# EAGLE board Spring2020 (EAGLE 9.5.1), part 1 of 2
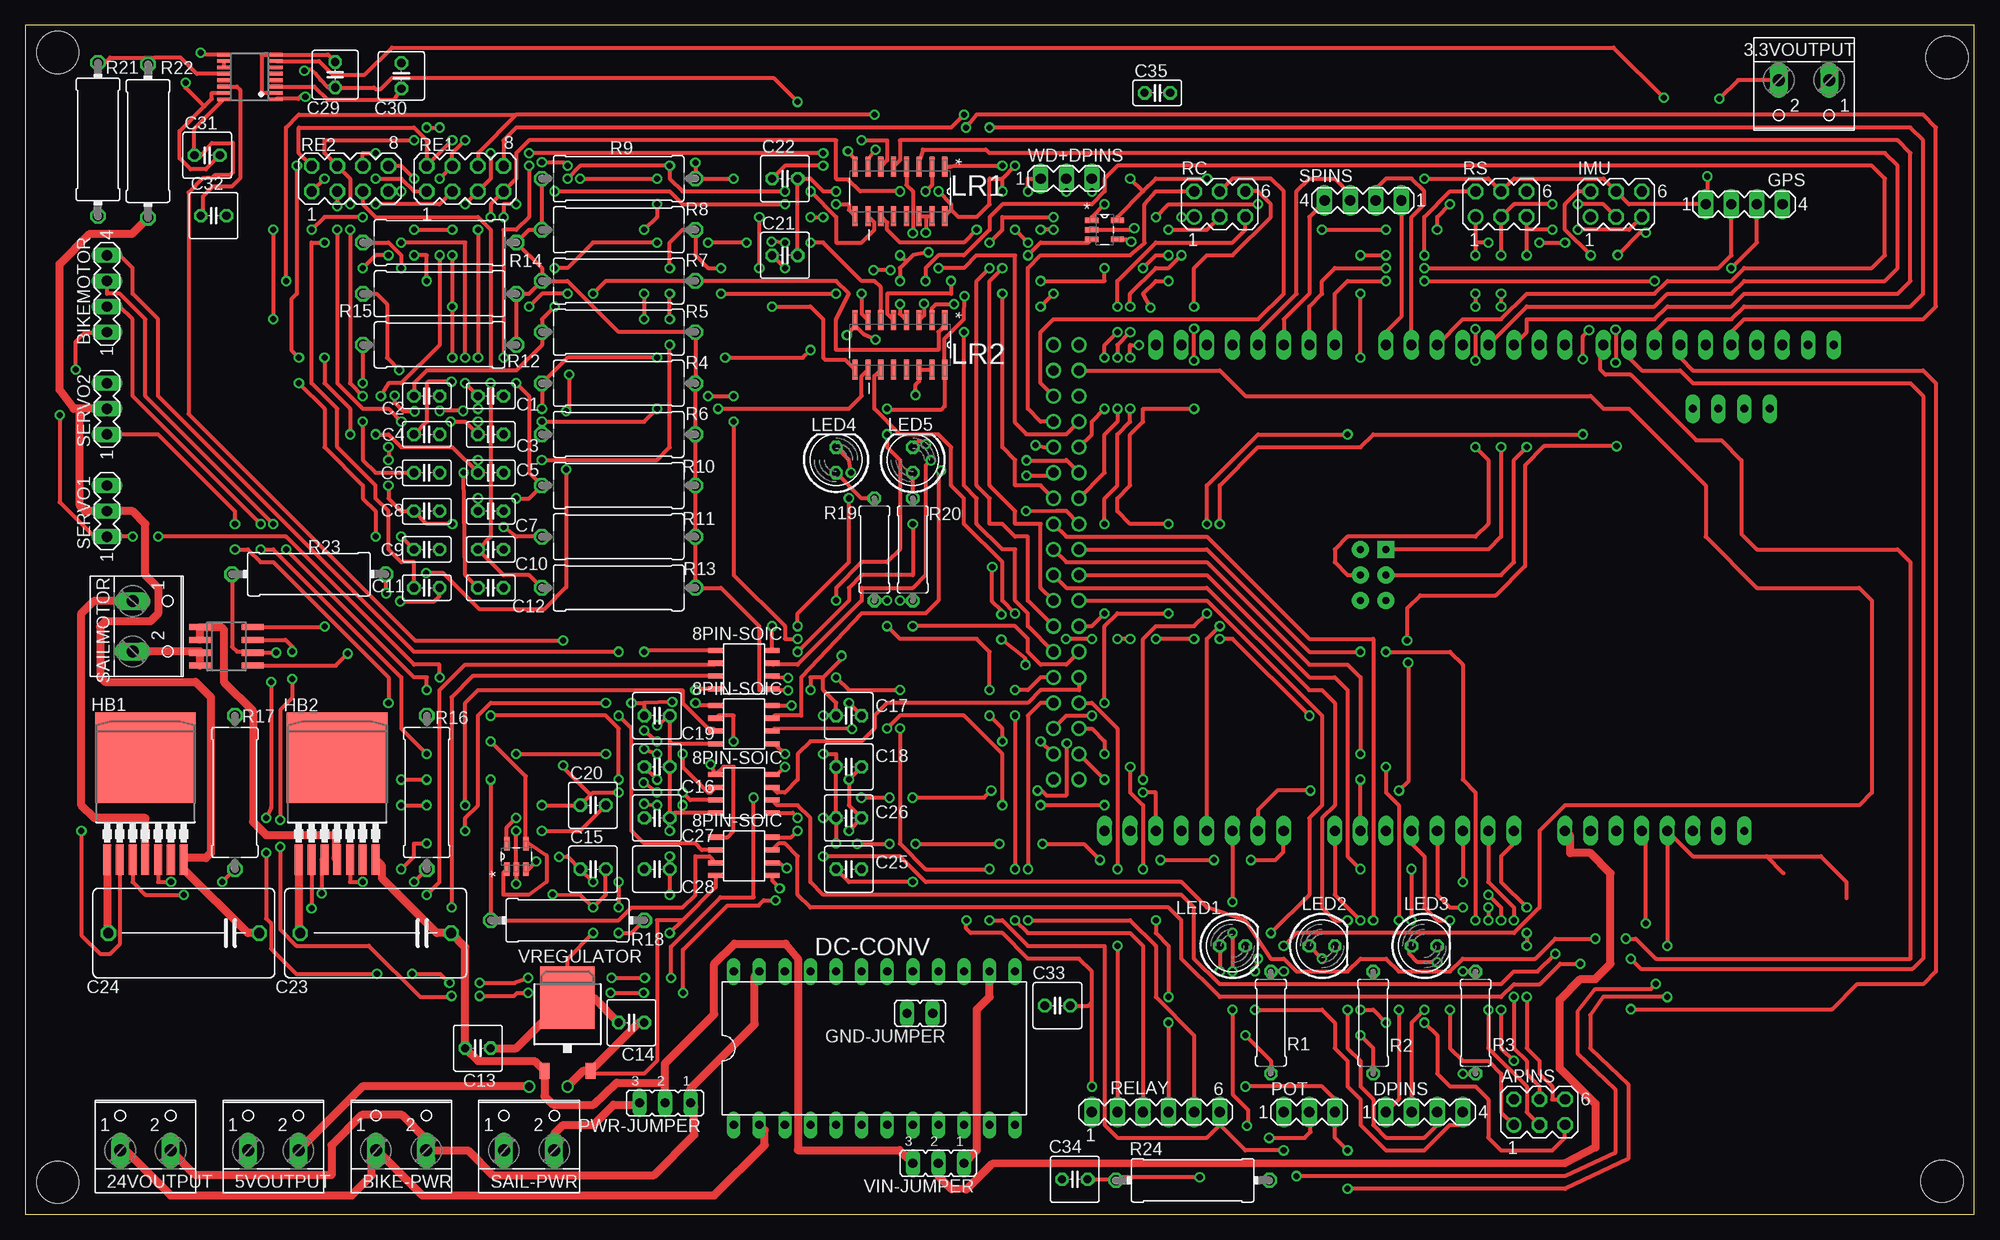
[diagram p2: board, top side]
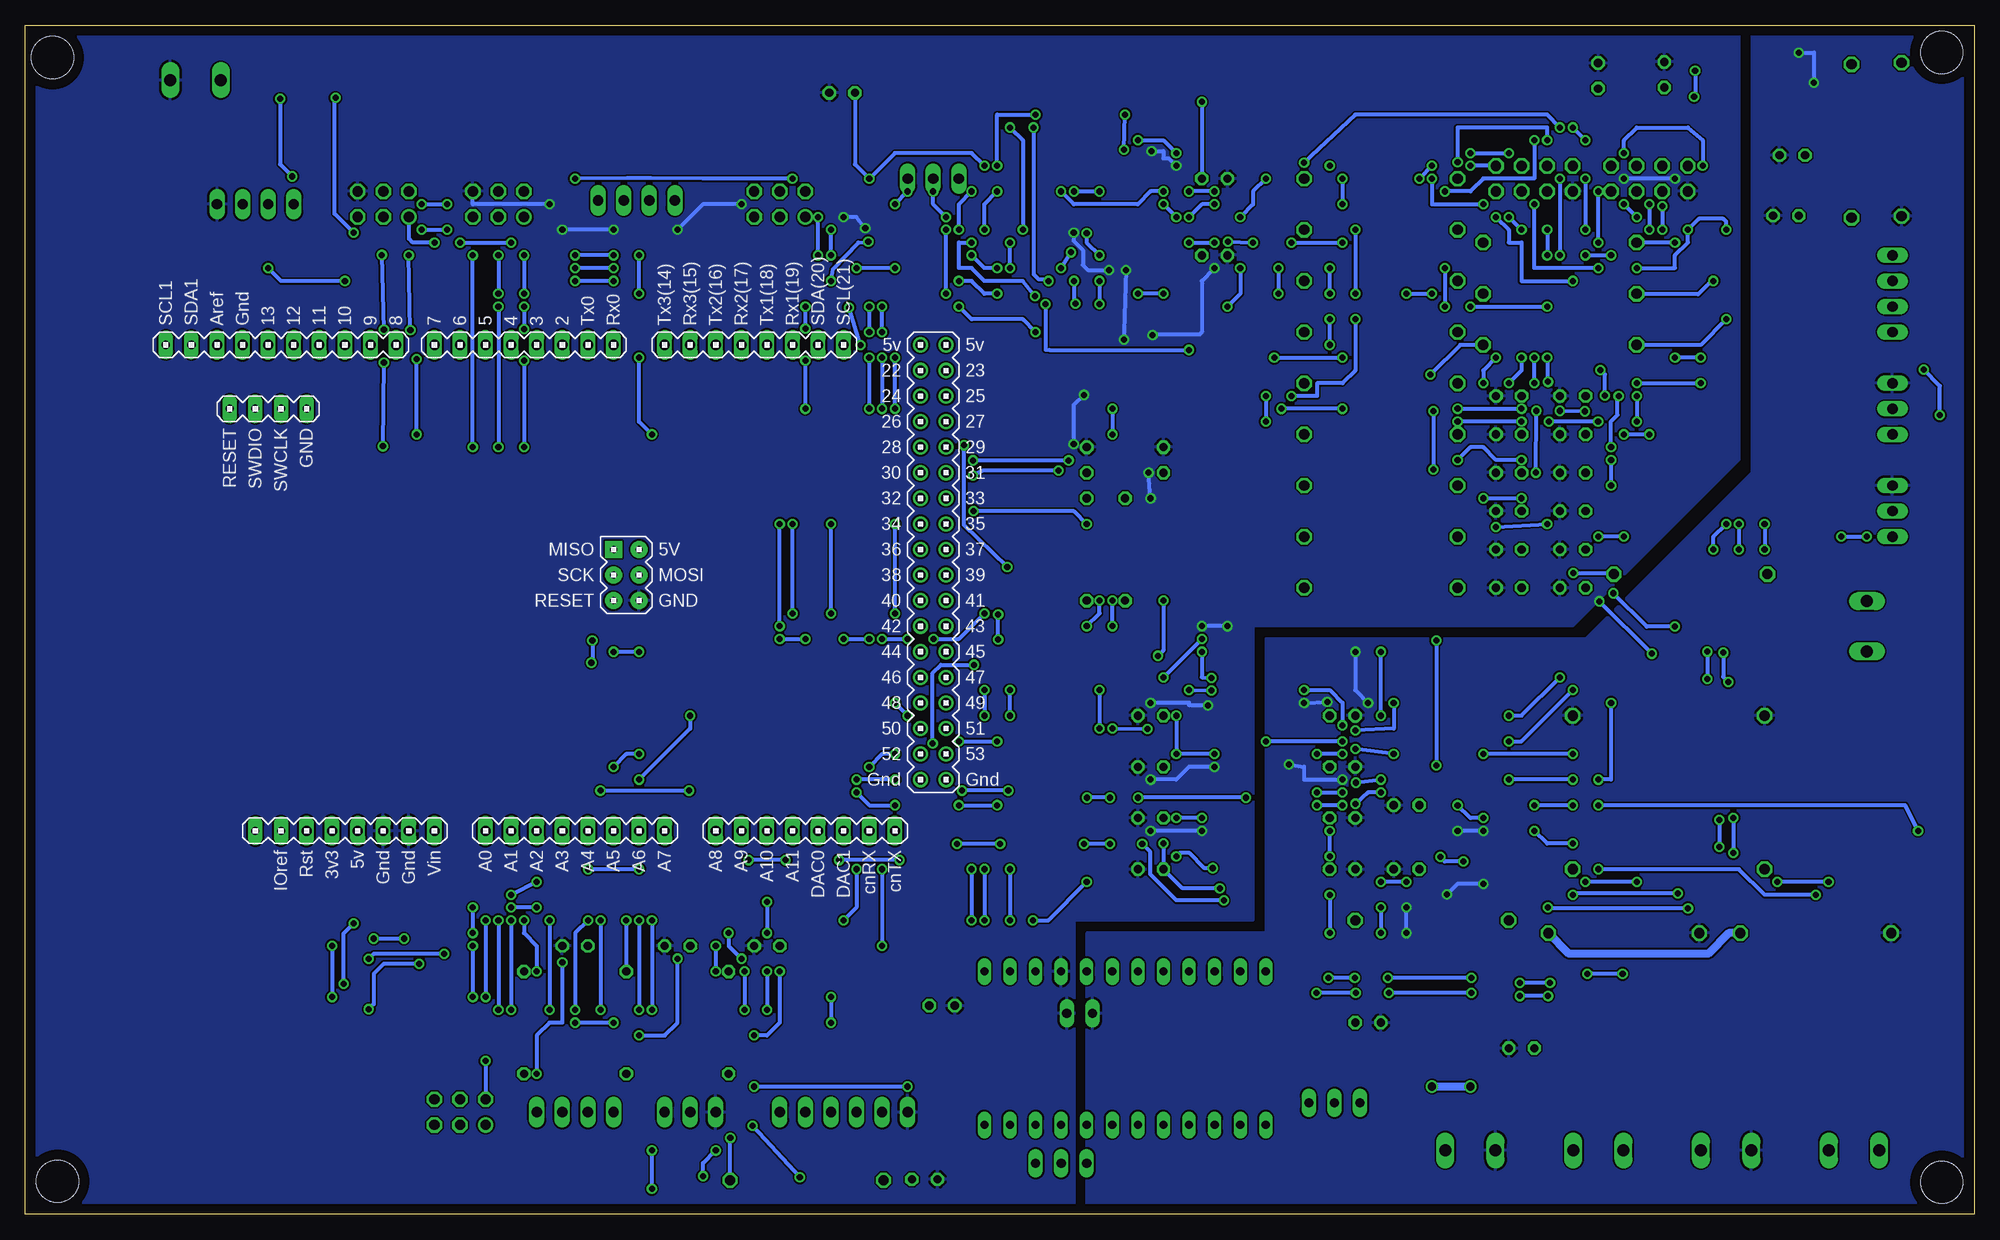
[diagram p3: board, bottom side, seen from below]

Size 193.55 x 118.11 mm. Coordinates in mm from the lower left corner, seen from the top.
Outline: 0,0 193.55,0 193.55,118.11 0,118.11 0,0
Copper layers (1*16): Top 0.035mm / dielectric 1.5mm / Bottom 0.035mm
Design rules "default *": minimum track width 10mil, minimum drill 0.6mm, track to track 7mil, track to pad 7mil, pad to pad 7mil, via to via 7mil, smd to smd 7mil, copper to edge 40mil, drill to drill 7mil, minimum pad ring 10mil, minimum via ring 8mil, stop-mask expansion 4mil, vias tented up to drill 0mil, thermal gap 10mil
Holes 4.2 mm at 3.23,3.19 3.23,115.39 190.83,114.89 190.33,3.29

## Footprints (pad centres in the part's own frame; a part is rotated, then mirrored left to right if it is on the bottom)
W237-102 = drill 1.194 long: 1 -2.5,-1.27; 2 2.5,-1.27
MA03-2 = drill 1.016: 1 -2.54,-1.27 | drill 1.016 octagon: 2 -2.54,1.27; 3 0,-1.27; 4 0,1.27; 5 2.54,-1.27; 6 2.54,1.27
MA04-1 = drill 1.016 long: 1 -3.81,0; 2 -1.27,0; 3 1.27,0; 4 3.81,0
C025-025X050 = drill 0.813 octagon: 1 -1.27,0; 2 1.27,0
C025-050X050 = drill 0.813 octagon: 1 -1.27,0; 2 1.27,0
C150-091X182 = drill 1.016 octagon: 1 -7.493,0; 2 7.493,0
DIL24-6 = drill 0.813 long: 1 -13.97,-7.62; 2 -11.43,-7.62; 3 -8.89,-7.62; 4 -6.35,-7.62; 5 -3.81,-7.62; 6 -1.27,-7.62; 7 1.27,-7.62; 8 3.81,-7.62; 9 6.35,-7.62; 10 8.89,-7.62; 11 11.43,-7.62; 12 13.97,-7.62; 13 13.97,7.62; 14 11.43,7.62; 15 8.89,7.62; 16 6.35,7.62; 17 3.81,7.62; 18 1.27,7.62; 19 -1.27,7.62; 20 -3.81,7.62; 21 -6.35,7.62; 22 -8.89,7.62; 23 -11.43,7.62; 24 -13.97,7.62
JP1 = drill 0.914 long: 1 0,-1.27; 2 0,1.27
P-TO263-7-1 = smd 0.8 x 3: 1 -3.81,-9.207; 2 -2.54,-9.207; 3 -1.27,-9.207; 4 0,-9.207; 5 1.27,-9.207; 6 2.54,-9.207; 7 3.81,-9.207 | smd 10 x 9: 8 0,0.895
LED5MM = drill 0.813 octagon: A -1.27,0; K 1.27,0
SOIC127P600X175-16N = smd 1.981 x 0.508: 1 -2.464,4.445; 2 -2.464,3.175; 3 -2.464,1.905; 4 -2.464,0.635; 5 -2.464,-0.635; 6 -2.464,-1.905; 7 -2.464,-3.175; 8 -2.464,-4.445; 9 2.464,-4.445; 10 2.464,-3.175; 11 2.464,-1.905; 12 2.464,-0.635; 13 2.464,0.635; 14 2.464,1.905; 15 2.464,3.175; 16 2.464,4.445
SOT95P280X145-5N = smd 1.321 x 0.559: 1 -1.27,0.94; 2 -1.27,0; 3 -1.27,-0.94; 4 1.27,-0.94; 5 1.27,0.94
MA03-1 = drill 1.016 long: 1 -2.54,0; 2 0,0; 3 2.54,0
JP2 = drill 0.914 long: 1 -2.54,0; 2 0,0; 3 2.54,0
0309/10 = drill 0.813 octagon: 1 -5.08,0; 2 5.08,0
P0613/15 = drill 1.016 octagon: 1 -7.62,0; 2 7.62,0
0414/15 = drill 1.016 octagon: 1 -7.62,0; 2 7.62,0
MA04-2 = drill 1.016 octagon: 1 -3.81,-1.27; 2 -3.81,1.27; 3 -1.27,-1.27; 4 -1.27,1.27; 5 1.27,-1.27; 6 1.27,1.27; 7 3.81,-1.27; 8 3.81,1.27
MA06-1 = drill 1.016 long: 1 -6.35,0; 2 -3.81,0; 3 -1.27,0; 4 1.27,0; 5 3.81,0; 6 6.35,0
DUE(NORMAL) = drill 1 long: 2 -16.51,30.48; 3 -19.05,30.48; 3V3 -39.37,-17.78; 4 -21.59,30.48; 5 -24.13,30.48; 5V -36.83,-17.78; 6 -26.67,30.48; 7 -29.21,30.48; 8 -33.02,30.48; 9 -35.56,30.48; 10 -38.1,30.48; 11 -40.64,30.48; 12 -43.18,30.48; 13 -45.72,30.48; A0 -24.13,-17.78; A1 -21.59,-17.78; A2 -19.05,-17.78; A3 -16.51,-17.78; A4 -13.97,-17.78; A5 -11.43,-17.78; A6 -8.89,-17.78; A7 -6.35,-17.78; A8 -1.27,-17.78; A9 1.27,-17.78; A10 3.81,-17.78; A11 6.35,-17.78; AREF -50.8,30.48; AREF1 -50.8,30.48; CANRX 13.97,-17.78; CANTX 16.51,-17.78; DAC0 8.89,-17.78; DAC1 11.43,-17.78; GND1 -48.26,30.48; GND_1 -34.29,-17.78; GND_2 -31.75,-17.78; RESET -41.91,-17.78; RX0 -11.43,30.48; RX1 6.35,30.48; RX2 1.27,30.48; RX3 -3.81,30.48; SCL 11.43,30.48; SDA 8.89,30.48; TX0 -13.97,30.48; TX1 3.81,30.48; TX2 -1.27,30.48; TX3 -6.35,30.48; VIN -29.21,-17.78 | drill 1: 5V_A 19.05,30.48; 5V_B 21.59,30.48; 22 19.05,27.94; 23 21.59,27.94; 24 19.05,25.4; 25 21.59,25.4; 26 19.05,22.86; 27 21.59,22.86; 28 19.05,20.32; 29 21.59,20.32; 30 19.05,17.78; 31 21.59,17.78; 32 19.05,15.24; 33 21.59,15.24; 34 19.05,12.7; 35 21.59,12.7; 36 19.05,10.16; 37 21.59,10.16; 38 19.05,7.62; 39 21.59,7.62; 40 19.05,5.08; 41 21.59,5.08; 42 19.05,2.54; 43 21.59,2.54; 44 19.05,0; 45 21.59,0; 46 19.05,-2.54; 47 21.59,-2.54; 48 19.05,-5.08; 49 21.59,-5.08; 50 19.05,-7.62; 51 21.59,-7.62; 52 19.05,-10.16; 53 21.59,-10.16; GND_A 19.05,-12.7; GND_B 21.59,-12.7 | drill 0.7 pad 1.676: 5V_ICSP -8.89,5.08; GND_ICSP -8.89,10.16; MOSI_ICSP -8.89,7.62; RESET_ICSP -11.43,5.08; SCK_ICSP -11.43,7.62 | drill 0.8 pad 1.422 long: GND_DEBUG -41.91,24.13; IOREF -44.45,-17.78; NC -46.99,-17.78; RESET_DEBUG -49.53,24.13; SCL1 -55.88,30.48; SDA1 -53.34,30.48; SWCLK_DEBUG -44.45,24.13; SWDIO_DEBUG -46.99,24.13 | drill 0.7 pad 1.676 square: MISO_ICSP -11.43,10.16
8PINSOIC = smd 1.524 x 0.508: 1 -2.794,2.286; 2 -2.794,1.016; 3 -2.794,-0.254; 4 -2.794,-1.524; 5 2.794,-1.524; 6 2.794,-0.254; 7 2.794,1.016; 8 2.794,2.286
QSOP16 = smd 0.381 x 1.27: 1 -2.223,-2.6; 2 -1.587,-2.6; 3 -0.953,-2.6; 4 -0.318,-2.6; 5 0.318,-2.6; 6 0.953,-2.6; 7 1.587,-2.6; 8 2.223,-2.6; 9 2.223,2.6; 10 1.587,2.6; 11 0.953,2.6; 12 0.318,2.6; 13 -0.318,2.6; 14 -0.953,2.6; 15 -1.587,2.6; 16 -2.223,2.6
SO8 = smd 0.6 x 2.2: 1 -1.905,-2.6; 2 -0.635,-2.6; 3 0.635,-2.6; 4 1.905,-2.6; 5 1.905,2.6; 6 0.635,2.6; 7 -0.635,2.6; 8 -1.905,2.6
TO252 = smd 1 x 1.6: 1 -2.28,-4.8; 2 2.28,-4.8 | smd 5.4 x 6.2: 3 0,2.5

## Placement (x,y rotation side)
3.3VOUTPUT  [W237-102]  176.63,111.39 180 top
5VOUTPUT  [W237-102]  24.64,7.62 0 top
24VOUTPUT  [W237-102]  11.94,7.62 0 top
APINS  [MA03-2]  150.37,10.16 0 top
BIKE-PWR  [W237-102]  37.34,7.62 0 top
BIKEMOTOR  [MA04-1]  8.13,91.44 90 top
C1  [C025-025X050]  46.23,81.28 0 top
C2  [C025-025X050]  39.88,81.28 0 top
C3  [C025-025X050]  46.23,77.47 0 top
C4  [C025-025X050]  39.88,77.47 0 top
C5  [C025-025X050]  46.23,73.66 0 top
C6  [C025-025X050]  39.88,73.66 0 top
C7  [C025-025X050]  46.23,69.85 0 top
C8  [C025-025X050]  39.88,69.85 0 top
C9  [C025-025X050]  39.88,66.04 0 top
C10  [C025-025X050]  46.23,66.04 0 top
C11  [C025-025X050]  39.88,62.23 0 top
C12  [C025-025X050]  46.23,62.23 0 top
C13  [C025-050X050]  44.96,16.51 0 top
C14  [C025-050X050]  60.2,19.05 180 top
C15  [C025-050X050]  56.39,34.29 0 top
C16  [C025-050X050]  62.74,44.45 180 top
C17  [C025-050X050]  81.79,49.53 0 top
C18  [C025-050X050]  81.79,44.45 0 top
C19  [C025-050X050]  62.74,49.53 180 top
C20  [C025-050X050]  56.39,40.64 0 top
C21  [C025-050X050]  75.44,95.25 0 top
C22  [C025-050X050]  75.44,102.87 0 top
C23  [C150-091X182]  34.8,27.94 180 top
C24  [C150-091X182]  15.75,27.94 180 top
C25  [C025-050X050]  81.79,34.29 0 top
C26  [C025-050X050]  81.79,39.37 0 top
C27  [C025-050X050]  62.74,39.37 180 top
C28  [C025-050X050]  62.74,34.29 180 top
C29  [C025-050X050]  30.79,113.19 90 top
C30  [C025-050X050]  37.36,113.08 90 top
C31  [C025-050X050]  18.08,105.19 0 top
C32  [C025-050X050]  18.71,99.19 0 top
C33  [C025-050X050]  102.51,20.74 180 top
C34  [C025-050X050]  104.23,3.49 180 top
C35  [C025-025X050]  112.43,111.39 0 top
DC-CONV  [DIL24-6]  84.33,16.51 0 top
DPINS  [MA04-1]  138.94,10.16 0 top
GND-JUMPER  [JP1]  88.85,19.97 90 top
GPS  [MA04-1]  170.69,100.33 0 top
HB1  BTN7971B  [P-TO263-7-1]  11.94,44.45 0 top
HB2  BTN7971B  [P-TO263-7-1]  30.99,44.45 0 top
IMU  [MA03-2]  157.99,100.33 0 top
LED1  [LED5MM]  119.89,26.67 0 top
LED2  [LED5MM]  128.78,26.67 0 top
LED3  [LED5MM]  138.94,26.67 0 top
LED4  [LED5MM]  80.52,74.93 90 top
LED5  [LED5MM]  88.14,74.93 90 top
LR1  ST26C32ABDR  [SOIC127P600X175-16N]  86.87,101.6 270 top
LR2  ST26C32ABDR  [SOIC127P600X175-16N]  86.87,86.36 270 top
OP-AMP  OPAMP  [SOT95P280X145-5N]  48.77,35.56 90 top
POT  [MA03-1]  127.51,10.16 0 top
PWR-JUMPER  [JP2]  63.54,11.08 180 top
R1  [0309/10]  123.7,19.05 270 top
R2  [0309/10]  133.86,19.05 270 top
R3  [0309/10]  144.02,19.05 270 top
R4  [P0613/15]  58.93,82.55 0 top
R5  [P0613/15]  58.93,87.63 0 top
R6  [P0613/15]  58.93,77.47 0 top
R7  [P0613/15]  58.93,92.71 0 top
R8  [P0613/15]  58.93,97.79 0 top
R9  [P0613/15]  58.93,102.87 0 top
R10  [P0613/15]  58.93,72.39 180 top
R11  [P0613/15]  58.93,67.31 180 top
R12  [P0613/15]  41.15,86.36 180 top
R13  [P0613/15]  58.93,62.23 180 top
R14  [P0613/15]  41.15,96.52 180 top
R15  [P0613/15]  41.15,91.44 180 top
R16  [P0613/15]  39.88,41.91 90 top
R17  [P0613/15]  20.83,41.91 90 top
R18  [0414/15]  53.85,29.21 0 top
R19  [0309/10]  84.33,66.04 90 top
R20  [0309/10]  88.14,66.04 90 top
R21  [0414/15]  7.23,106.76 90 top
R22  [0414/15]  12.2,106.6 270 top
R23  [0414/15]  28.17,63.59 0 top
R24  [0414/15]  115.93,3.39 180 top
RC  [MA03-2]  118.62,100.33 0 top
RE1  [MA04-2]  43.69,102.87 0 top
RE2  [MA04-2]  32.26,102.87 0 top
RELAY  [MA06-1]  112.27,10.16 0 top
RS  [MA03-2]  146.56,100.33 0 top
SAIL-PWR  [W237-102]  50.04,7.62 0 top
SAILMOTOR  [W237-102]  11.94,58.42 270 top
SERVO1  [MA03-1]  8.13,69.85 90 top
SERVO2  [MA03-1]  8.13,80.01 90 top
SPINS  [MA04-1]  132.84,100.71 180 top
U$1  DUE(NORMAL)  [DUE(NORMAL)]  123.7,55.88 0 bottom
U$2  IL-711  [8PINSOIC]  71.37,42.16 180 top
U$3  IL-711  [8PINSOIC]  71.37,54.48 180 top
U$4  WATCHDOG  [SOT95P280X145-5N]  107.19,97.79 0 top
U$5  ISOLATED_ERROR_AMP_ADUM3190  [QSOP16]  22.32,112.96 90 top
U$6  IL-711  [8PINSOIC]  71.37,49.02 180 top
U$7  IL-712  [8PINSOIC]  71.37,35.94 180 top
U$8  LINEAR_CURRENT_SENSOR_ACS711  [SO8]  19.98,56.42 270 top
VIN-JUMPER  [JP2]  90.68,5.08 180 top
VREGULATOR  7818DT  [TO252]  53.85,19.05 0 top
WD+DPINS  [MA03-1]  103.38,102.87 0 top